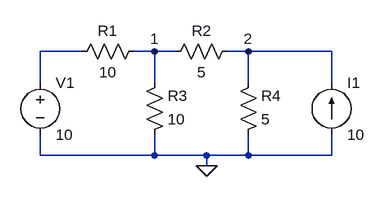
[diagram p0: schematic circuit-4.asc]
circuit-4.asc, the LTspice schematic file:
Version 4
SHEET 1 880 680
WIRE 32 96 -32 96
WIRE 144 96 112 96
WIRE 176 96 144 96
WIRE 288 96 256 96
WIRE 416 96 288 96
WIRE -32 144 -32 96
WIRE 144 144 144 96
WIRE 288 144 288 96
WIRE 416 144 416 96
WIRE -32 256 -32 224
WIRE 144 256 144 224
WIRE 144 256 -32 256
WIRE 224 256 144 256
WIRE 288 256 288 224
WIRE 288 256 224 256
WIRE 416 256 416 224
WIRE 416 256 288 256
WIRE 224 272 224 256
FLAG 224 272 0
FLAG 144 96 1
FLAG 288 96 2
SYMBOL res 128 80 R90
WINDOW 0 0 56 VBottom 2
WINDOW 3 32 56 VTop 2
SYMATTR InstName R1
SYMATTR Value 10
SYMBOL res 272 80 R90
WINDOW 0 0 56 VBottom 2
WINDOW 3 32 56 VTop 2
SYMATTR InstName R2
SYMATTR Value 5
SYMBOL res 128 240 M180
WINDOW 0 36 76 Left 2
WINDOW 3 36 40 Left 2
SYMATTR InstName R3
SYMATTR Value 10
SYMBOL res 272 240 M180
WINDOW 0 36 76 Left 2
WINDOW 3 36 40 Left 2
SYMATTR InstName R4
SYMATTR Value 5
SYMBOL current 416 224 M180
WINDOW 0 24 80 Left 2
WINDOW 3 24 0 Left 2
WINDOW 123 0 0 Left 2
WINDOW 39 0 0 Left 2
SYMATTR InstName I1
SYMATTR Value 10
SYMBOL voltage -32 128 R0
SYMATTR InstName V1
SYMATTR Value 10

The netlist it stands for:
* circuit-4.asc
R1 1 N001 10
R2 2 1 5
R3 0 1 10
R4 0 2 5
I1 0 2 10
V1 N001 0 10
.backanno
.end